# EAGLE design MDAS_Controller_V1 (EAGLE 9.0.0)
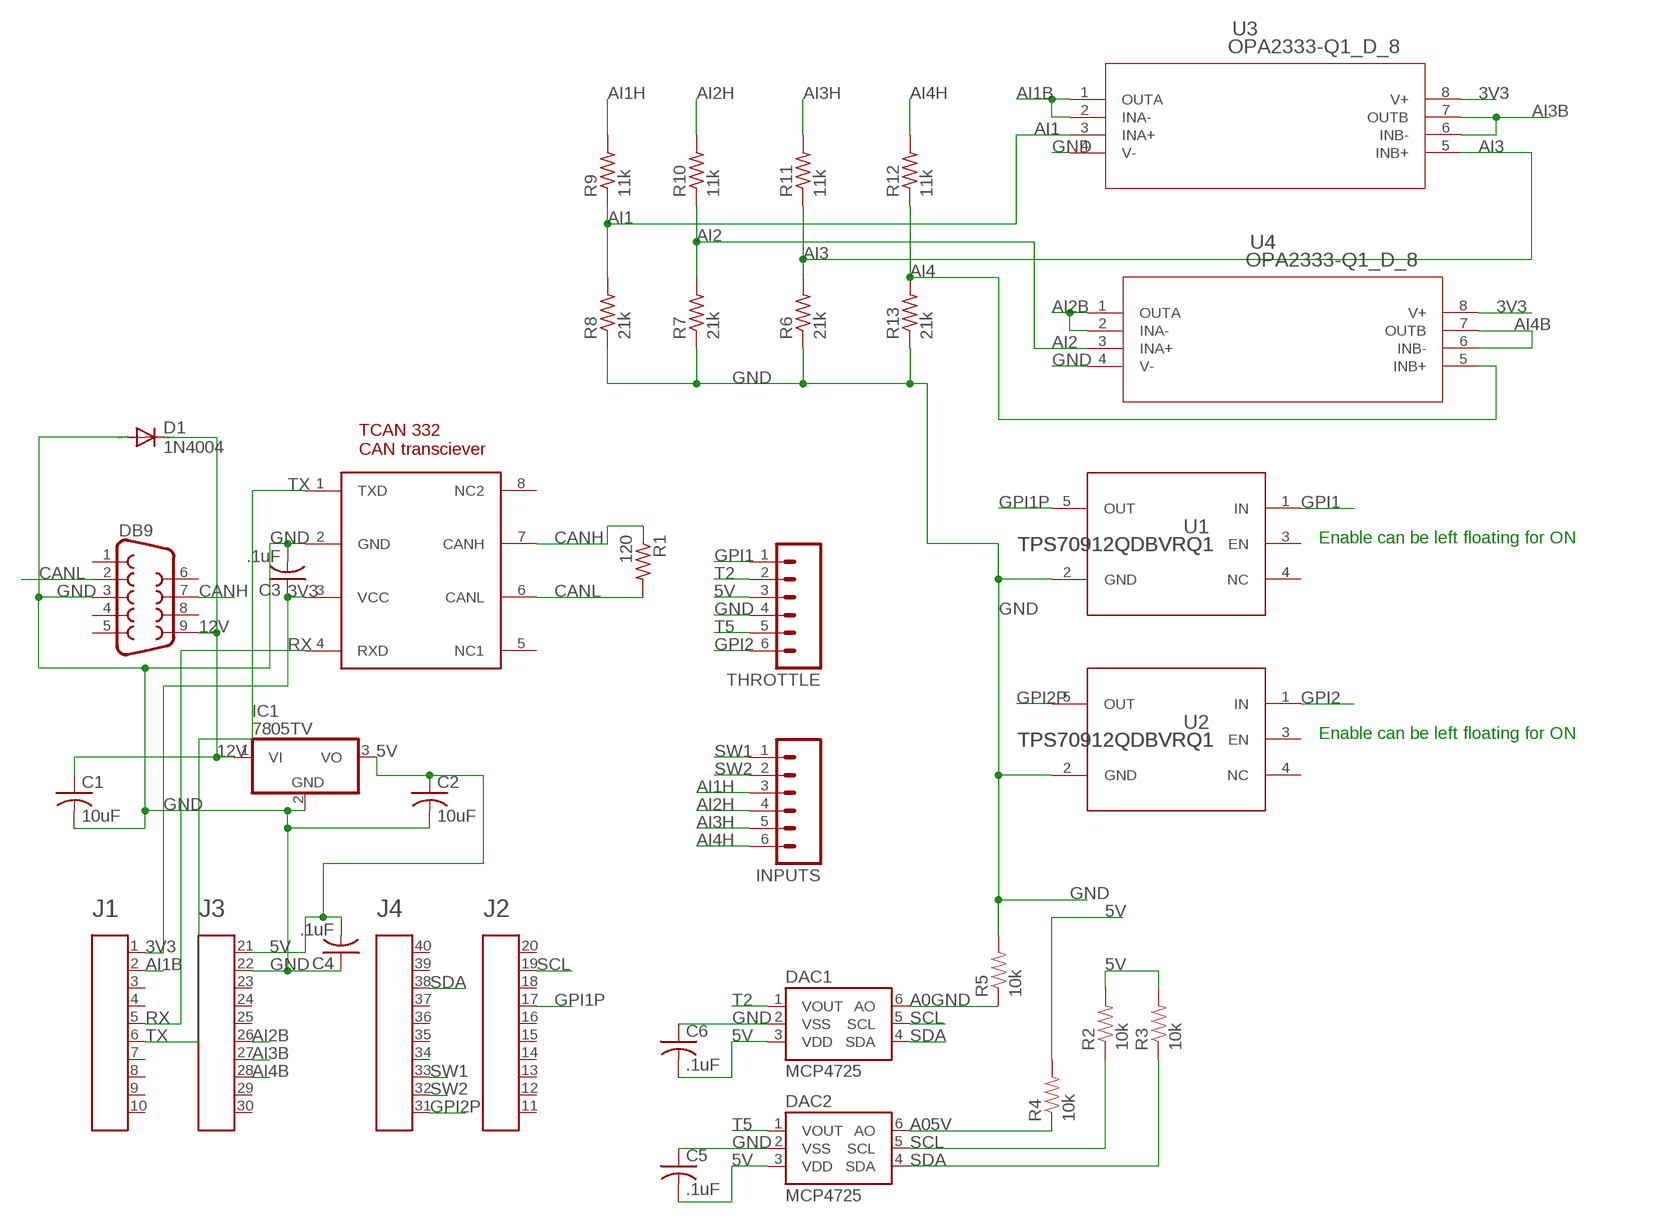
[diagram p0: schematic, sheet 1]

## Parts
A1  HEADER4X10-BOOSTERPACK  [4X10-BOOSTERPACK]
C1  10uF  C-USC1206K  [C1206K]
C2  10uF  C-USC1206K  [C1206K]
C3  .1uF  C-USC0603  [C0603]
C4  .1uF  C-USC0603  [C0603]
C5  .1uF  C-USC0603  [C0603]
C6  .1uF  C-USC0603  [C0603]
CAN_TRANSCIEVER  TCAN332  [SOIC127P600X172-8N]
D1  1N4004  [DO41-10]
DAC1  MCP4725  MCP4725SOT-23  [SOT23-6]
DAC2  MCP4725  MCP4725SOT-23  [SOT23-6]
DB9  DB9FEMALE  [DB9]
IC1  7805TV  [TO220V]
INPUTS  M06SMD-1MM  [1X06-1MM]
R1  120  R-US_0207/10  [0207/10]
R2  10k  RESISTOR0603-RES  [0603-RES]
R3  10k  RESISTOR0603-RES  [0603-RES]
R4  10k  RESISTOR0603-RES  [0603-RES]
R5  10k  RESISTOR0603-RES  [0603-RES]
R6  21k  R-US_R0603  [R0603]
R7  21k  R-US_R0603  [R0603]
R8  21k  R-US_R0603  [R0603]
R9  11k  R-US_R0603  [R0603]
R10  11k  R-US_R0603  [R0603]
R11  11k  R-US_R0603  [R0603]
R12  11k  R-US_R0603  [R0603]
R13  21k  R-US_R0603  [R0603]
THROTTLE  M06SMD-1MM  [1X06-1MM]
U1  TPS70912QDBVRQ1  [DBV0005A_N]
U2  TPS70912QDBVRQ1  [DBV0005A_N]
U3  OPA2333-Q1_D_8  [D8]
U4  OPA2333-Q1_D_8  [D8]

## Nets
3V3: A1.1 C3.1 CAN_TRANSCIEVER.3(VCC) U3.8(V+) U4.8(V+)
5V: A1.21 C2.1 C4.2 C5.2 C6.2 DAC1.3(VDD) DAC2.3(VDD) IC1.3(VO) R2.2 R3.2 R4.2 THROTTLE.3
12V: C1.1 D1.C DB9.9 IC1.1(VI)
A0GND: DAC1.6(AO) R5.1
A05V: DAC2.6(AO) R4.1
AI1: R8.2 R9.1 U3.3(INA+)
AI1B: A1.2 U3.1(OUTA) U3.2(INA-)
AI1H: INPUTS.3 R9.2
AI2: R7.2 R10.1 U4.3(INA+)
AI2B: A1.26 U4.1(OUTA) U4.2(INA-)
AI2H: INPUTS.4 R10.2
AI3: R6.2 R11.1 U3.5(INB+)
AI3B: A1.27 U3.6(INB-) U3.7(OUTB)
AI3H: INPUTS.5 R11.2
AI4: R12.1 R13.2 U4.5(INB+)
AI4B: A1.28 U4.6(INB-) U4.7(OUTB)
AI4H: INPUTS.6 R12.2
CANH: CAN_TRANSCIEVER.7(CANH) DB9.7 R1.1
CANL: CAN_TRANSCIEVER.6(CANL) DB9.2 R1.2
GND: A1.22 C1.2 C2.2 C3.2 C4.1 C5.1 C6.1 CAN_TRANSCIEVER.2(GND) D1.A DAC1.2(VSS) DAC2.2(VSS) DB9.3 IC1.2(GND) R5.2 R6.1 R7.1 R8.1 R13.1 THROTTLE.4 U1.2(GND) U2.2(GND) U3.4(V-) U4.4(V-)
GPI1: THROTTLE.1 U1.1(IN)
GPI1P: A1.17 U1.5(OUT)
GPI2: THROTTLE.6 U2.1(IN)
GPI2P: A1.31 U2.5(OUT)
RX: A1.5 CAN_TRANSCIEVER.4(RXD)
SCL: A1.19 DAC1.5(SCL) DAC2.5(SCL) R2.1
SDA: A1.38 DAC1.4(SDA) DAC2.4(SDA) R3.1
SW1: A1.33 INPUTS.1
SW2: A1.32 INPUTS.2
T2: DAC1.1(VOUT) THROTTLE.2
T5: DAC2.1(VOUT) THROTTLE.5
TX: A1.6 CAN_TRANSCIEVER.1(TXD)
Unconnected: A1.3 A1.4 A1.7 A1.8 A1.9 A1.10 A1.11 A1.12 A1.13 A1.14 A1.15 A1.16 A1.18 A1.20 A1.23 A1.24 A1.25 A1.29 A1.30 A1.34 A1.35 A1.36 A1.37 A1.39 A1.40 CAN_TRANSCIEVER.5(NC1) CAN_TRANSCIEVER.8(NC2) DB9.1 DB9.4 DB9.5 DB9.6 DB9.8 U1.3(EN) U1.4(NC) U2.3(EN) U2.4(NC)

## Notes on the sheet
- Enable can be left floating for ON
- Enable can be left floating for ON

## Library data of the parts
A1 = EAGLE_BoosterPack_Library:HEADER4X10-BOOSTERPACK
C1-C6 = adafruit:C-US: CAPACITOR, American symbol
CAN_TRANSCIEVER = Texas Instruments_By_element14_Batch_1:TCAN332
D1 = diode:1N4004: DIODE general purpose rectifier, 1 A
DAC1 DAC2 = SparkFun-AnalogIC:MCP4725: Microchip 12-bit I2C DAC, SOT23-6; PROD_ID: IC-08886
DB9 = SparkFun-Connectors:DB9: DB9 Connector Standard DB9 (D-Sub 9) serial connector. Can be used for CAN bus as well as RS485 and RS232. Footprint production proven. Here is the female version connector we sell at SparkFun: 9 Pin Female Serial Connector - PCB Mount <https://www.sparkfun.com/products/429> (PRT-00429) This connector has been used on the following SparkFun products: SparkFun RS232 Shifter - SMD <https://www.sparkfun.com/products/449> (PRT-00449) SparkFun RS232 Shifter SMD (No DB9) <https://www.sparkfun.com/products/8780> (PRT-08780); PROD_ID: CONN-08194
IC1 = linear:78*: Positive VOLTAGE REGULATOR Source: http://cache.national.com/ds/LM/LM78L05.pdf http://www.fairchildsemi.com/ds/LM/LM7805.pdf
INPUTS THROTTLE = SparkFun-Connectors:M06: Header 6 Standard 6-pin 0.1" header. Use with straight break away headers (SKU : PRT-00116), right angle break away headers (PRT-00553), swiss pins (PRT-00743), machine pins (PRT-00117), and female headers (PRT-00115). Molex polarized connector foot print use with SKU : PRT-08094 with associated crimp pins and housings. NOTES ON THE VARIANTS LOCK and LOCK_LONGPADS... This footprint was designed to help hold the alignment of a through-hole component (i.e. 6-pin header) while soldering it into place. You may notice that each hole has been shifted either up or down by 0.005 of an inch from it's more standard position (which is a perfectly straight line). This slight alteration caused the pins (the squares in the middle) to touch the edges of the holes. Because they are alternating, it causes a "brace" to hold the component in place. 0.005 has proven to be the perfect amount of "off-center" position when using our standard breakaway headers. Although looks a little odd when you look at the bare footprint, once you have a header in there, the alteration is very hard to notice. Also,if you push a header all the way into place, it is covered up entirely on the bottom side. This idea of altering the position of holes to aid alignment will be further integrated into the Sparkfun Library for other footprints. It can help hold any component with 3 or more connection pins.
R1 R6-R13 = adafruit:R-US_: RESISTOR, American symbol
R2-R5 = SparkFun-Passives:RESISTOR: Resistor Basic schematic elements and footprints for 0603, 1206, and PTH resistors.
U1 U2 = TPS70933DBVR:TPS70912QDBVRQ1
U3 U4 = OPA2333AQDRQ1:OPA2333-Q1_D_8; MANUFACTURER_PART_NUMBER: opa2333q1_d_8; VENDOR: Texas Instruments

## Board
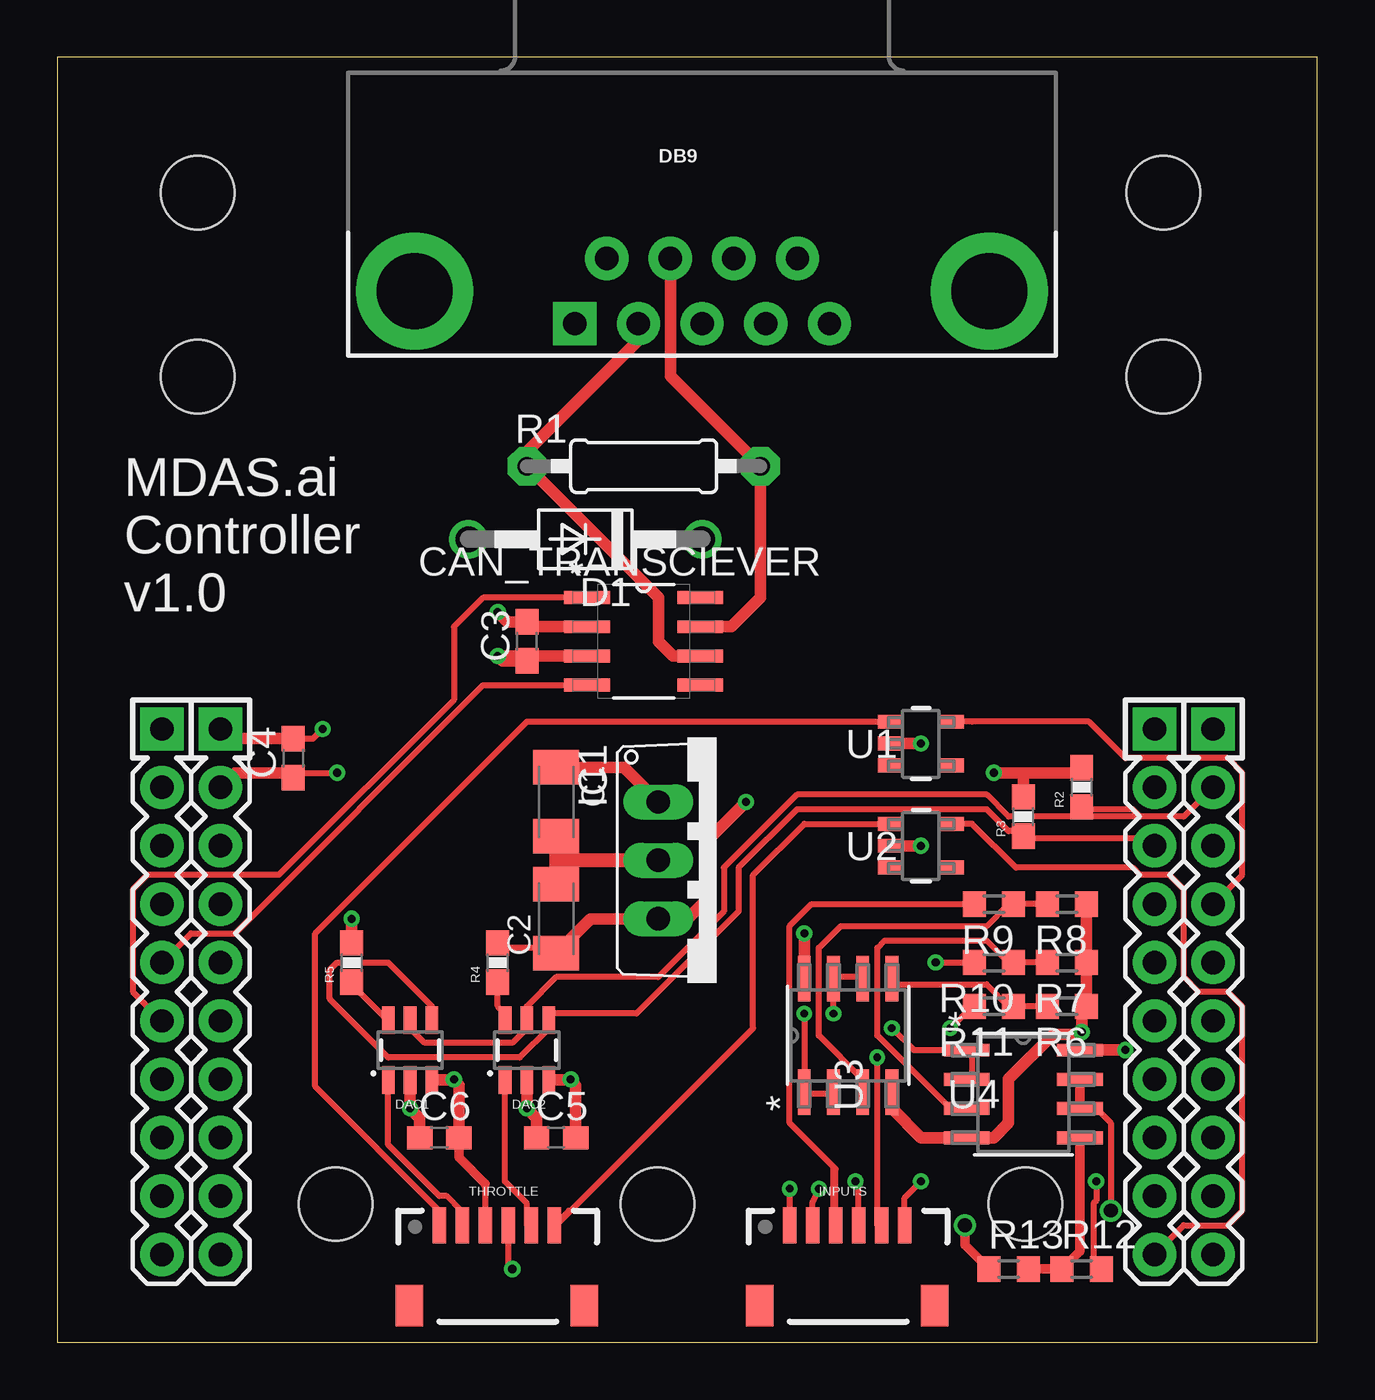
[diagram p1: board, top side]
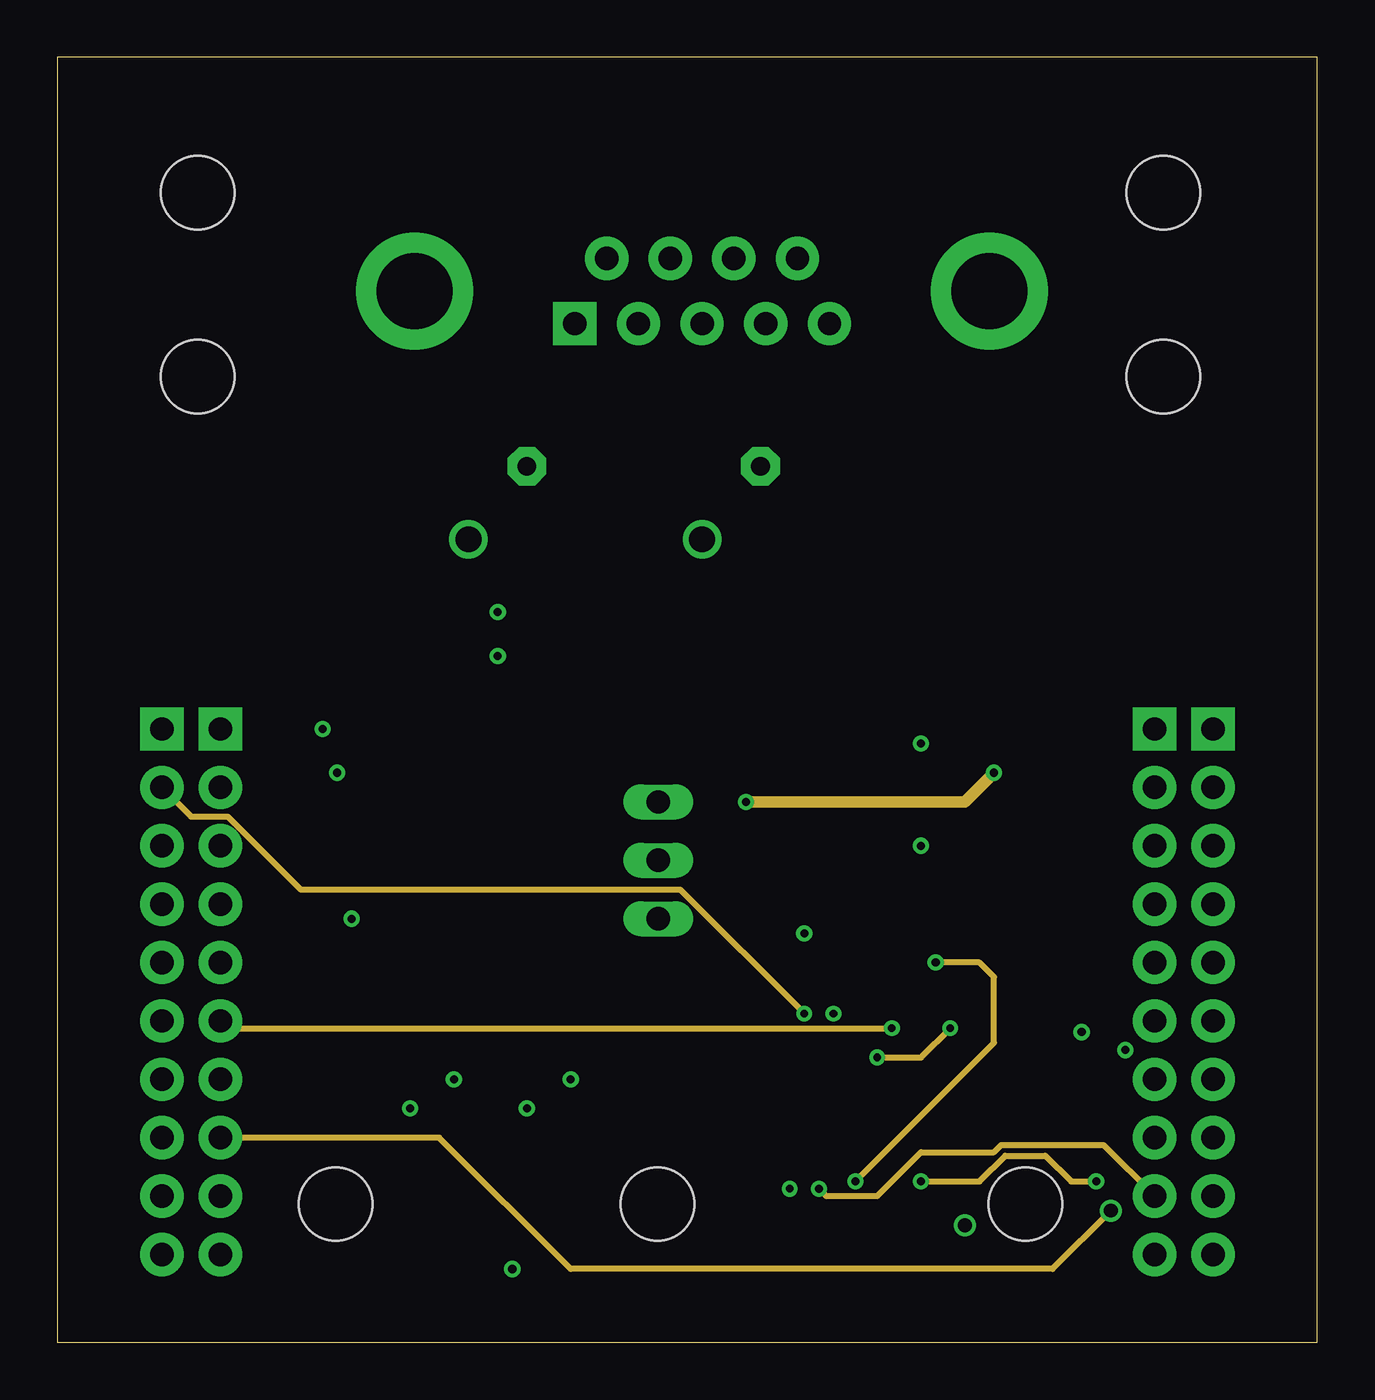
[diagram p2: board, inner layer Route2]
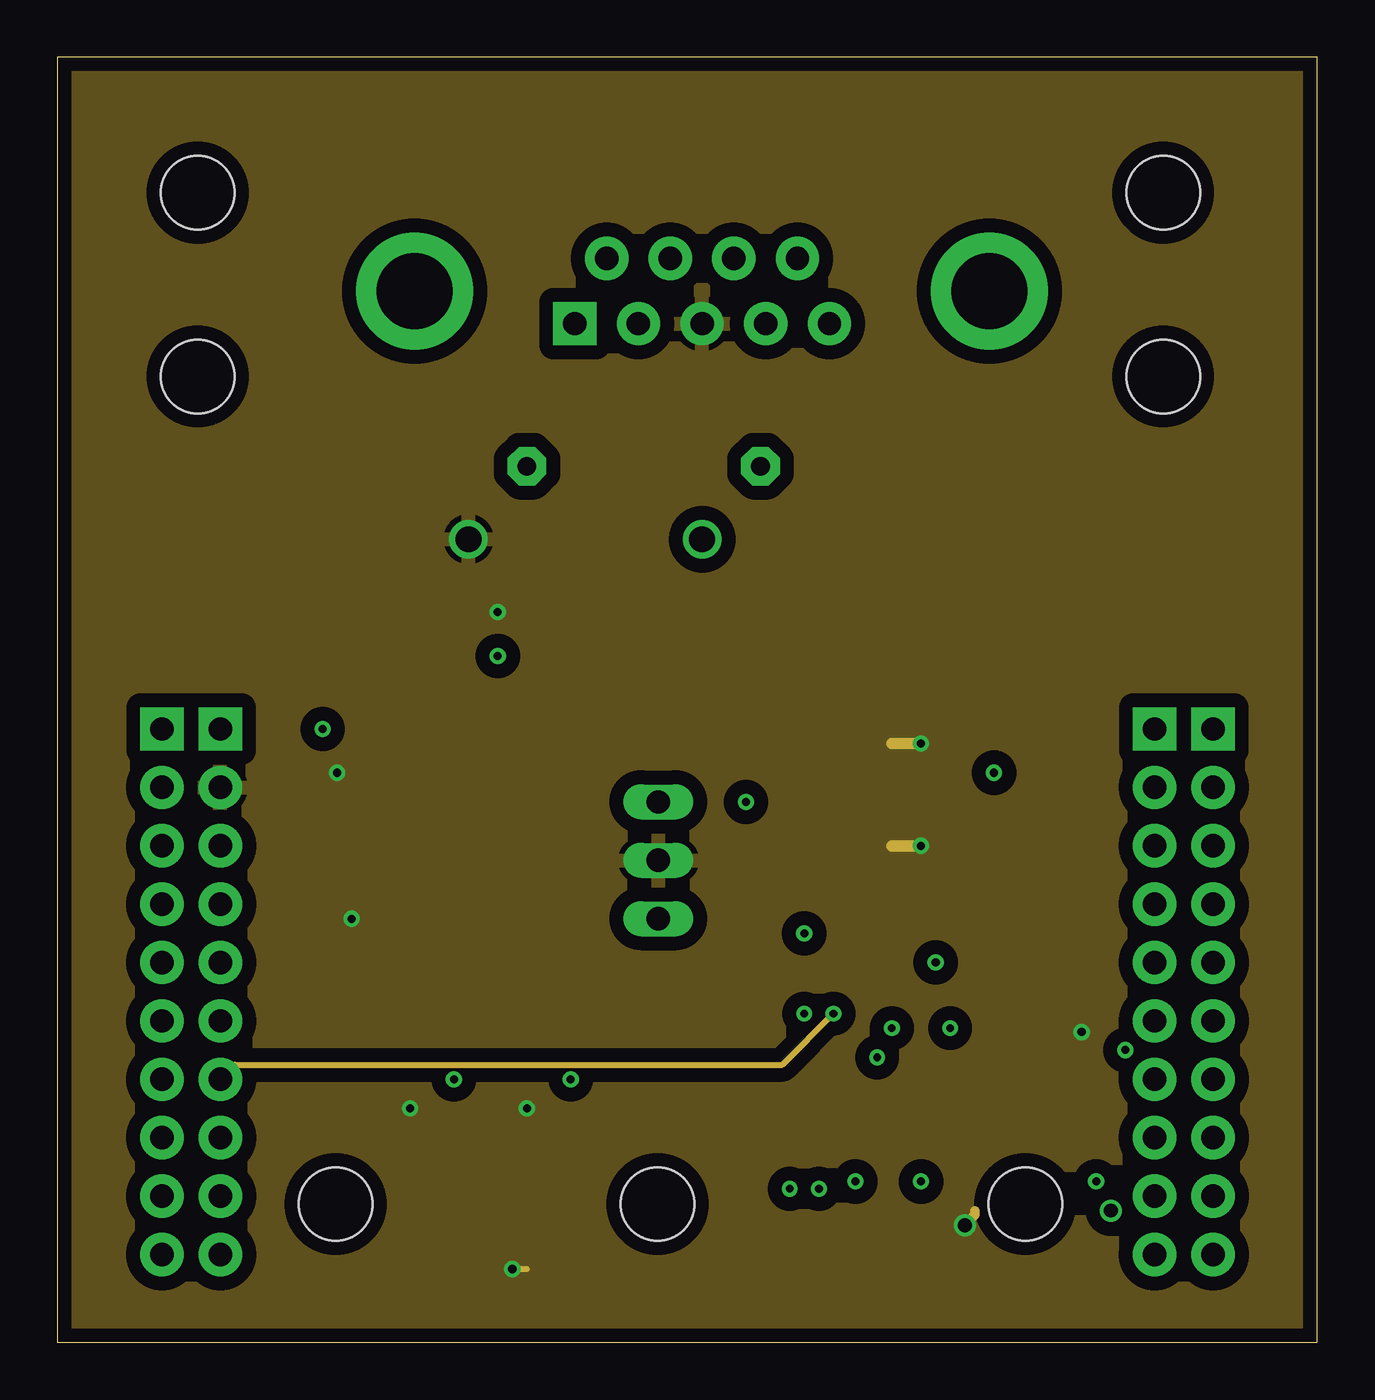
[diagram p3: board, inner layer Route15]
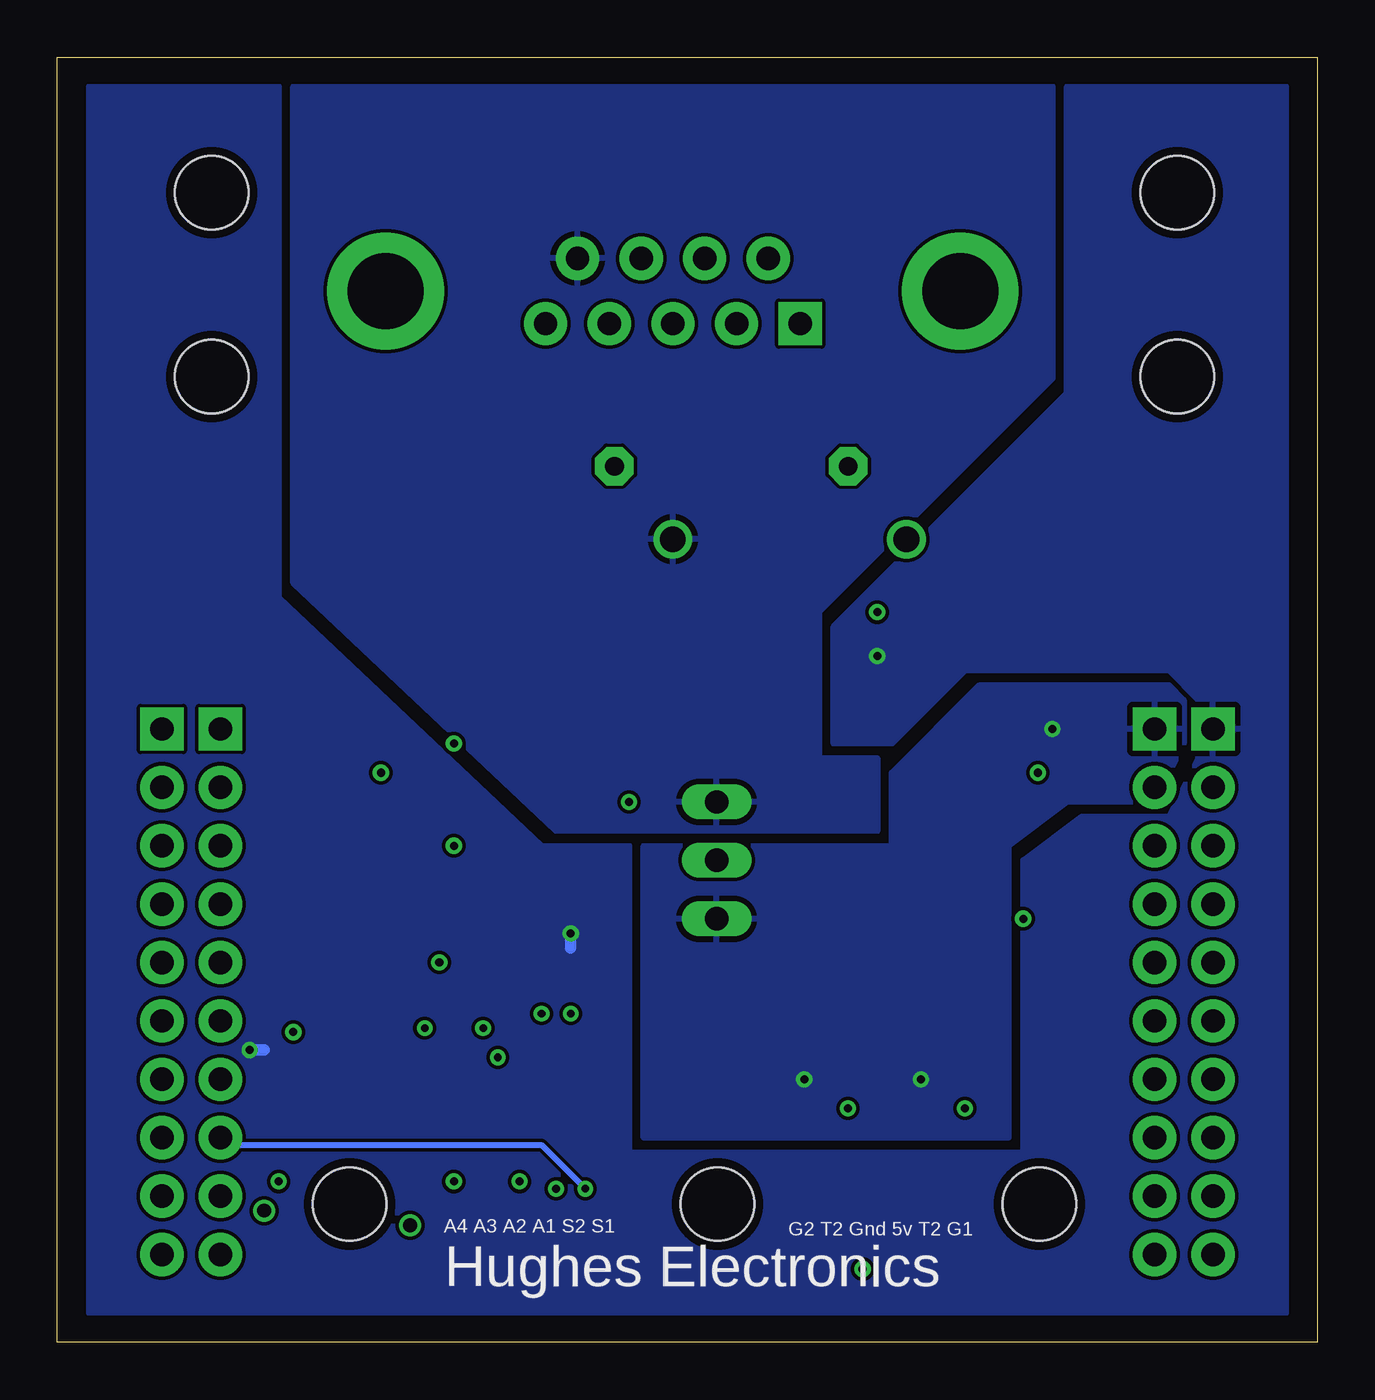
[diagram p4: board, bottom side, seen from below]

Size 54.81 x 55.88 mm. Coordinates in mm from the lower left corner, seen from the top.
Outline: 0,0 54.81,0 54.81,55.88 0,55.88 0,0
Copper layers (1*2+15*16): Top 0.0356mm / dielectric 1.5011mm / Route2 0.0356mm / dielectric 0.1499mm / Route15 0.0356mm / dielectric 0.2007mm / Bottom 0.0356mm
Design rules "LaenPCBOrder *": minimum track width 10mil, minimum drill 13mil, track to track 6mil, track to pad 6mil, pad to pad 6mil, via to via 6mil, smd to smd 6mil, copper to edge 15mil, drill to drill 6mil, minimum pad ring 7mil, minimum via ring 7mil, stop-mask expansion 3mil, vias tented up to drill 0mil, thermal gap 10mil
Holes 3.2 mm at 12.1,6 26.1,6 42.1,6 6.1,50 48.1,50 6.1,42 48.1,42

### Footprints (pad centres in the part's own frame; a part is rotated, then mirrored left to right if it is on the bottom)
4X10-BOOSTERPACK = drill 1.016 pad 1.88 square: 1 0,10.16; 20 45.72,10.16; 21 2.54,10.16; 40 43.18,10.16 | drill 1.016 pad 1.88: 2 0,7.62; 3 0,5.08; 4 0,2.54; 5 0,0; 6 0,-2.54; 7 0,-5.08; 8 0,-7.62; 9 0,-10.16; 10 0,-12.7; 11 45.72,-12.7; 12 45.72,-10.16; 13 45.72,-7.62; 14 45.72,-5.08; 15 45.72,-2.54; 16 45.72,0; 17 45.72,2.54; 18 45.72,5.08; 19 45.72,7.62; 22 2.54,7.62; 23 2.54,5.08; 24 2.54,2.54; 25 2.54,0; 26 2.54,-2.54; 27 2.54,-5.08; 28 2.54,-7.62; 29 2.54,-10.16; 30 2.54,-12.7; 31 43.18,-12.7; 32 43.18,-10.16; 33 43.18,-7.62; 34 43.18,-5.08; 35 43.18,-2.54; 36 43.18,0; 37 43.18,2.54; 38 43.18,5.08; 39 43.18,7.62
C1206K = smd 1.5 x 2: 1 -1.5,0; 2 1.5,0
C0603 = smd 1.1 x 1: 1 -0.85,0; 2 0.85,0
SOIC127P600X172-8N = smd 1.981 x 0.559: 1 -2.464,1.905; 2 -2.464,0.635; 3 -2.464,-0.635; 4 -2.464,-1.905; 5 2.464,-1.905; 6 2.464,-0.635; 7 2.464,0.635; 8 2.464,1.905
DO41-10 = drill 1.118: A 5.08,0; C -5.08,0
SOT23-6 = smd 0.55 x 1.2: 1 0.95,1.3; 2 0,1.3; 3 -0.95,1.3; 4 -0.95,-1.3; 5 0,-1.3; 6 0.95,-1.3
DB9 = drill 1.016 pad 1.88 square: 1 -5.54,-1.42 | drill 1.016 pad 1.88: 2 -2.77,-1.42; 3 0,-1.42; 4 2.77,-1.42; 5 5.54,-1.42; 6 -4.15,1.42; 7 -1.38,1.42; 8 1.38,1.42; 9 4.15,1.42 | drill 3.302 pad 5.08: G1 -12.5,0; G2 12.5,0
TO220V = drill 1.016 long: 1 -2.54,-2.54; 2 0,-2.54; 3 2.54,-2.54
1X06-1MM = smd 0.6 x 1.55: 1 -2.54,1.27; 2 -1.54,1.27; 3 -0.54,1.27; 4 0.46,1.27; 5 1.46,1.27; 6 2.46,1.27 | smd 1.2 x 1.8: P$1 -3.84,-2.225; P$2 3.76,-2.225
0207/10 = drill 0.813 pad 1.676 octagon: 1 -5.08,0; 2 5.08,0
0603-RES = smd 1.1 x 1: 1 -0.85,0; 2 0.85,0
R0603 = smd 1 x 1.1: 1 -0.85,0; 2 0.85,0
DBV0005A_N = smd 1 x 0.6: 1 -1.375,0.95; 2 -1.375,0; 3 -1.375,-0.95; 4 1.375,-0.95; 5 1.375,0.95
D8 = smd 1.981 x 0.559: 1 -2.464,1.905; 2 -2.464,0.635; 3 -2.464,-0.635; 4 -2.464,-1.905; 5 2.464,-1.905; 6 2.464,-0.635; 7 2.464,0.635; 8 2.464,1.905

### Placement (x,y rotation side)
A1  4.55,16.51 0 top
C1  21.69,23.5 270 top
C2  21.69,18.41 90 top
C3  20.42,30.48 90 top
C4  10.26,25.4 90 top
C5  21.69,8.89 0 top
C6  16.61,8.89 0 top
CAN_TRANSCIEVER  25.5,30.48 0 top
D1  22.96,34.92 180 top
DAC1  15.34,12.7 180 top
DAC2  20.42,12.7 180 top
DB9  28.04,45.72 0 top
IC1  28.68,20.95 270 top
INPUTS  34.39,3.81 0 top
R1  25.5,38.1 180 top
R2  44.55,24.13 90 top
R3  42.01,22.86 90 top
R4  19.15,16.51 90 top
R5  12.8,16.51 90 top
R6  43.92,14.61 180 top
R7  43.92,16.51 180 top
R8  43.92,19.05 180 top
R9  40.74,19.05 180 top
R10  40.74,16.51 180 top
R11  40.74,14.61 180 top
R12  44.55,3.17 0 top
R13  41.38,3.17 0 top
THROTTLE  19.15,3.81 0 top
U1  37.57,26.04 0 top
U2  37.57,21.59 0 top
U3  34.39,13.34 90 top
U4  42.01,10.79 0 top

### Tracks (layer width: path | path; a pad name or v marks a point on that pad's centre or on a via)
3V3  (via drill 0.35)
  Top 0.254: U4.8 43.92,12.7
  Top 0.508: U4.8 v46.46,12.7 | U3.8 v32.49,17.78 | C3.1 19.37,29.63 v19.15,29.84 CAN_TRANSCIEVER.3
  Bottom 0.508: v46.46,12.7 45.82,12.7 | v32.49,17.78 32.49,17.14
  pour Bottom: 10.9,54.61 1.37,54.61 1.37,1.27 53.44,1.27 53.44,54.61 45.19,54.61 45.19,32.38 33.76,21.59 29.95,21.59 29.95,8.26 12.8,8.26 12.8,20.95 10.26,22.86 6.45,22.86 5.18,25.4 5.18,27.94 6.45,29.21 15.34,29.21 18.52,26.04 21.06,26.04 21.06,31.11 10.9,41.27
5V  (via drill 0.35)
  Top 0.254: R4.2 19.15,17.14 21.69,17.14 C2.1 | 18.61,6.89 THROTTLE.3 | C4.2 11.11,26.25 v11.53,26.67
  Top 0.406: C6.2 17.46,8.04 18.61,6.89
  Top 0.508: A1.21 7.51,26.25 C4.2 | C2.1 23.19,18.41 IC1.3 27.41,18.41 28.36,19.37 28.36,21.91 v29.95,23.5 | DAC1.3 17.22,11.4 | 17.22,11.4 v17.25,11.43 | DAC2.3 22.3,11.4 | 22.3,11.4 v22.33,11.43 | C5.2 22.54,11.15 22.3,11.4 | C6.2 17.46,11.15 17.22,11.4 | R2.2 44.34,24.77 42.01,24.77 | 42.01,24.77 R3.2 | 42.01,24.77 v40.74,24.77
  Route2 0.508: v40.74,24.77 39.47,23.5 v29.95,23.5
  pour Bottom: 5.82,26.04 7.09,23.5 10.9,23.5 13.44,21.59 13.44,8.89 29.31,8.89 29.31,21.59 18.52,21.59 18.52,24.77 14.71,28.57 6.45,28.57 5.82,27.94
12V
  Top 0.508: C1.1 24.64,25 IC1.1
  pour Bottom: 19.15,22.23 33.12,22.23 44.55,33.02 44.55,54.61 11.53,54.61 11.53,41.91 21.69,31.75 21.69,25.4 19.15,25.4
A0GND
  Top 0.254: R5.1 12.8,15.56 14.39,13.97 DAC1.6
A05V
  Top 0.254: R4.1 19.15,14.61 19.47,14.29 DAC2.6
AI1
  Top 0.254: R8.2 R9.1 41.38,19.05 40.42,18.1 34.07,18.1 33.12,17.14 33.12,13.34 35.03,11.43 U3.3
AI1B  (via drill 0.33)
  Top 0.254: U3.2 33.76,10.79 32.49,10.79 U3.1 v32.49,14.29
  Route2 0.254: v32.49,14.29 27.09,19.68 10.58,19.68 7.4,22.86 5.82,22.86 A1.2
AI1H
  Top 0.254: R9.2 32.8,19.05 31.85,18.1 31.85,9.53 33.76,7.62 | 33.76,5.08 33.76,7.62 | INPUTS.3 33.85,7.53 33.76,7.62
AI2
  Top 0.254: R7.2 R10.1 41.38,16.51 40.42,17.46 35.98,17.46 35.66,17.14 35.66,13.34 38.84,10.16 U4.3
AI2B  (via drill 0.33)
  Top 0.254: U4.2 39.79,11.43 39.79,12.7 U4.1 37.25,12.7 v36.3,13.65
  Route2 0.254: v36.3,13.65 7.4,13.65 A1.26
AI2H  (via drill 0.35)
  Top 0.254: 40.11,16.51 R10.2 v38.2,16.51 | INPUTS.4 34.85,6.84 v34.71,6.99
  Route2 0.254: v34.71,6.99 40.74,13.02 40.74,15.88 40.11,16.51 v38.2,16.51
AI3
  Top 0.254: R6.2 R11.1 41.38,14.61 40.42,15.56 36.3,15.56 U3.5
AI3B  (via drill 0.33)
  Top 0.254: U3.6 35.03,15.88 33.76,15.88 U3.7 v33.76,14.29
  Route15 0.254: v33.76,14.29 31.53,12.06 7.72,12.06 A1.27
AI3H  (via drill 0.33)
  Top 0.254: v38.84,13.65 39.79,14.61 R11.2 | 35.66,5.08 35.66,5.27 | v35.66,12.38 35.66,5.71 35.66,5.27 | INPUTS.5 35.66,5.27
  Route2 0.254: v38.84,13.65 37.57,12.38 v35.66,12.38
AI4
  Top 0.406: R13.2 R12.1 44.48,3.95 U4.5
AI4B  (via drill 0.6)
  Top 0.254: U4.6 45.19,10.16 45.82,9.53 v45.82,5.71
  Top 0.406: U4.7 U4.6
  Route2 0.254: v45.82,5.71 43.28,3.17 22.33,3.17 16.61,8.89 A1.28
AI4H  (via drill 0.35)
  Top 0.254: v37.57,6.99 36.85,6.27 INPUTS.6 | v45.19,6.99 45.19,6.15 45.06,6.03 45.06,3.51 R12.2
  Route2 0.254: v37.57,6.99 40.11,6.99 41.23,8.11 42.97,8.11 44.1,6.99 v45.19,6.99
CANH
  Top 0.508: DB9.7 26.66,42.02 R1.1 30.58,32.38 29.31,31.11 CAN_TRANSCIEVER.7
CANL
  Top 0.508: DB9.2 25.27,43.59 20.42,38.73 R1.2 26.14,32.38 26.14,30.48 26.77,29.84 CAN_TRANSCIEVER.6
GND  (via drill 0.35, 0.6)
  Top 0.254: 44.87,16.51 R7.1 | 15.98,8.89 C6.1 | THROTTLE.4 19.61,3.35 v19.79,3.17 | C4.1 10.48,24.77 v12.17,24.77
  Top 0.406: R13.1 39.47,4.23 v39.47,5.08
  Top 0.508: A1.22 7.72,24.77 10.05,24.77 C4.1 | U3.4 36.3,10.16 37.57,8.89 U4.4 40.74,8.89 41.38,9.53 41.38,11.45 43.32,13.39 44.45,13.39 v44.55,13.48 44.55,14.39 R6.1 R7.1 R8.1 | U1.2 v37.57,26.04 | U2.2 v37.57,21.59 | CAN_TRANSCIEVER.2 20.64,31.11 C3.2 19.57,31.33 v19.15,31.75 | R5.2 v12.8,18.41 | DAC2.2 v20.42,10.16 20.84,9.74 C5.1 | DAC1.2 v15.34,10.16 15.76,9.74 C6.1
  Top 0.61: C1.2 21.69,20.95 | 21.69,20.95 C2.2 | IC1.2 21.69,20.95
  Route15 0.254: v19.79,3.17 20.42,3.17
  Route15 0.406: v39.47,5.08 39.92,5.53 39.92,5.71
  Route15 0.508: v37.57,26.04 36.3,26.04 | v37.57,21.59 36.3,21.59
  pour Route15 (isolate 0.61): 0.1,55.88 54.71,55.88 54.71,0 0.1,0
  pour Route15 (isolate 0.61): 0.1,55.88 54.71,55.88 54.71,0 0.1,0
GPI1
  Top 0.254: U1.1 32.8,26.99 20.42,26.99 11.21,17.78 11.21,11.11 16.61,5.71 THROTTLE.1
GPI1P
  Top 0.254: A1.17 51.54,20.32 51.54,24.77 50.9,25.4 46.46,25.4 44.87,26.99 39.79,26.99 U1.5
GPI2
  Top 0.254: 21.69,5.08 22.33,5.71 | 22.33,5.71 30.26,13.65 30.26,20.32 32.49,22.54 U2.1 | THROTTLE.6 22.25,5.71 22.33,5.71
GPI2P
  Top 0.254: A1.31 49,5.08 50.9,5.08 51.54,5.71 51.54,14.61 50.9,15.24 49.63,15.24 49,15.88 49,19.68 48.36,20.32 47.09,20.32 46.77,20.64 41.69,20.64 39.79,22.54 U2.5
RX
  Top 0.254: CAN_TRANSCIEVER.4 18.52,28.57 7.72,17.78 5.82,17.78 A1.5
SCL
  Top 0.254: DAC1.5 15.34,13.65 15.98,13.02 19.79,13.02 20.42,13.65 DAC2.5 20.42,14.61 21.69,15.88 26.14,15.88 28.99,18.73 28.99,20.64 32.17,23.81 40.42,23.81 41.38,22.86 47.09,22.86 | 47.09,22.86 46.77,23.18 44.55,23.18 R2.1 | 47.09,22.86 49,22.86 A1.19
SDA
  Top 0.254: DAC1.4 16.29,14.29 16.29,14.61 14.39,16.51 12.17,16.51 11.85,16.19 11.85,14.92 14.39,12.38 20.1,12.38 21.37,13.65 21.37,13.97 DAC2.4 21.37,14.29 25.18,14.29 29.63,18.73 29.63,20.64 32.17,23.18 40.42,23.18 41.38,22.23 42.01,22.23 R3.1 42.01,21.91 47.41,21.91 A1.38
SW1  (via drill 0.33)
  Top 0.254: v31.85,6.67 INPUTS.1
  Bottom 0.254: v31.85,6.67 33.76,8.57 47.41,8.57 A1.33
SW2  (via drill 0.35)
  Top 0.254: v33.12,6.67 32.85,6.08 INPUTS.2
  Route2 0.254: A1.32 45.5,8.57 41.06,8.57 40.74,8.26 37.57,8.26 35.66,6.35 33.44,6.35 v33.12,6.67
T2
  Top 0.254: DAC1.1 14.39,11.11 14.39,8.57 16.61,6.35 16.93,6.35 17.56,5.71 17.56,5.08 THROTTLE.2
T5
  Top 0.254: 20.42,5.08 20.42,5.27 | DAC2.1 19.47,11.11 19.47,6.99 20.42,6.03 20.42,5.27 | THROTTLE.5 20.42,5.27
TX
  Top 0.254: CAN_TRANSCIEVER.1 18.52,32.38 17.25,31.11 17.25,27.94 9.63,20.32 3.91,20.32 3.28,19.68 3.28,15.24 A1.6

### Text on the board
tNames: MDAS.ai / Controller / v1.0
bNames: G2 T2 Gnd 5v T2 G1 | A4 A3 A2 A1 S2 S1 | Hughes Electronics